# EAGLE design MSP430Geiger (EAGLE 8.1.0)

## Sheet 1 of 4
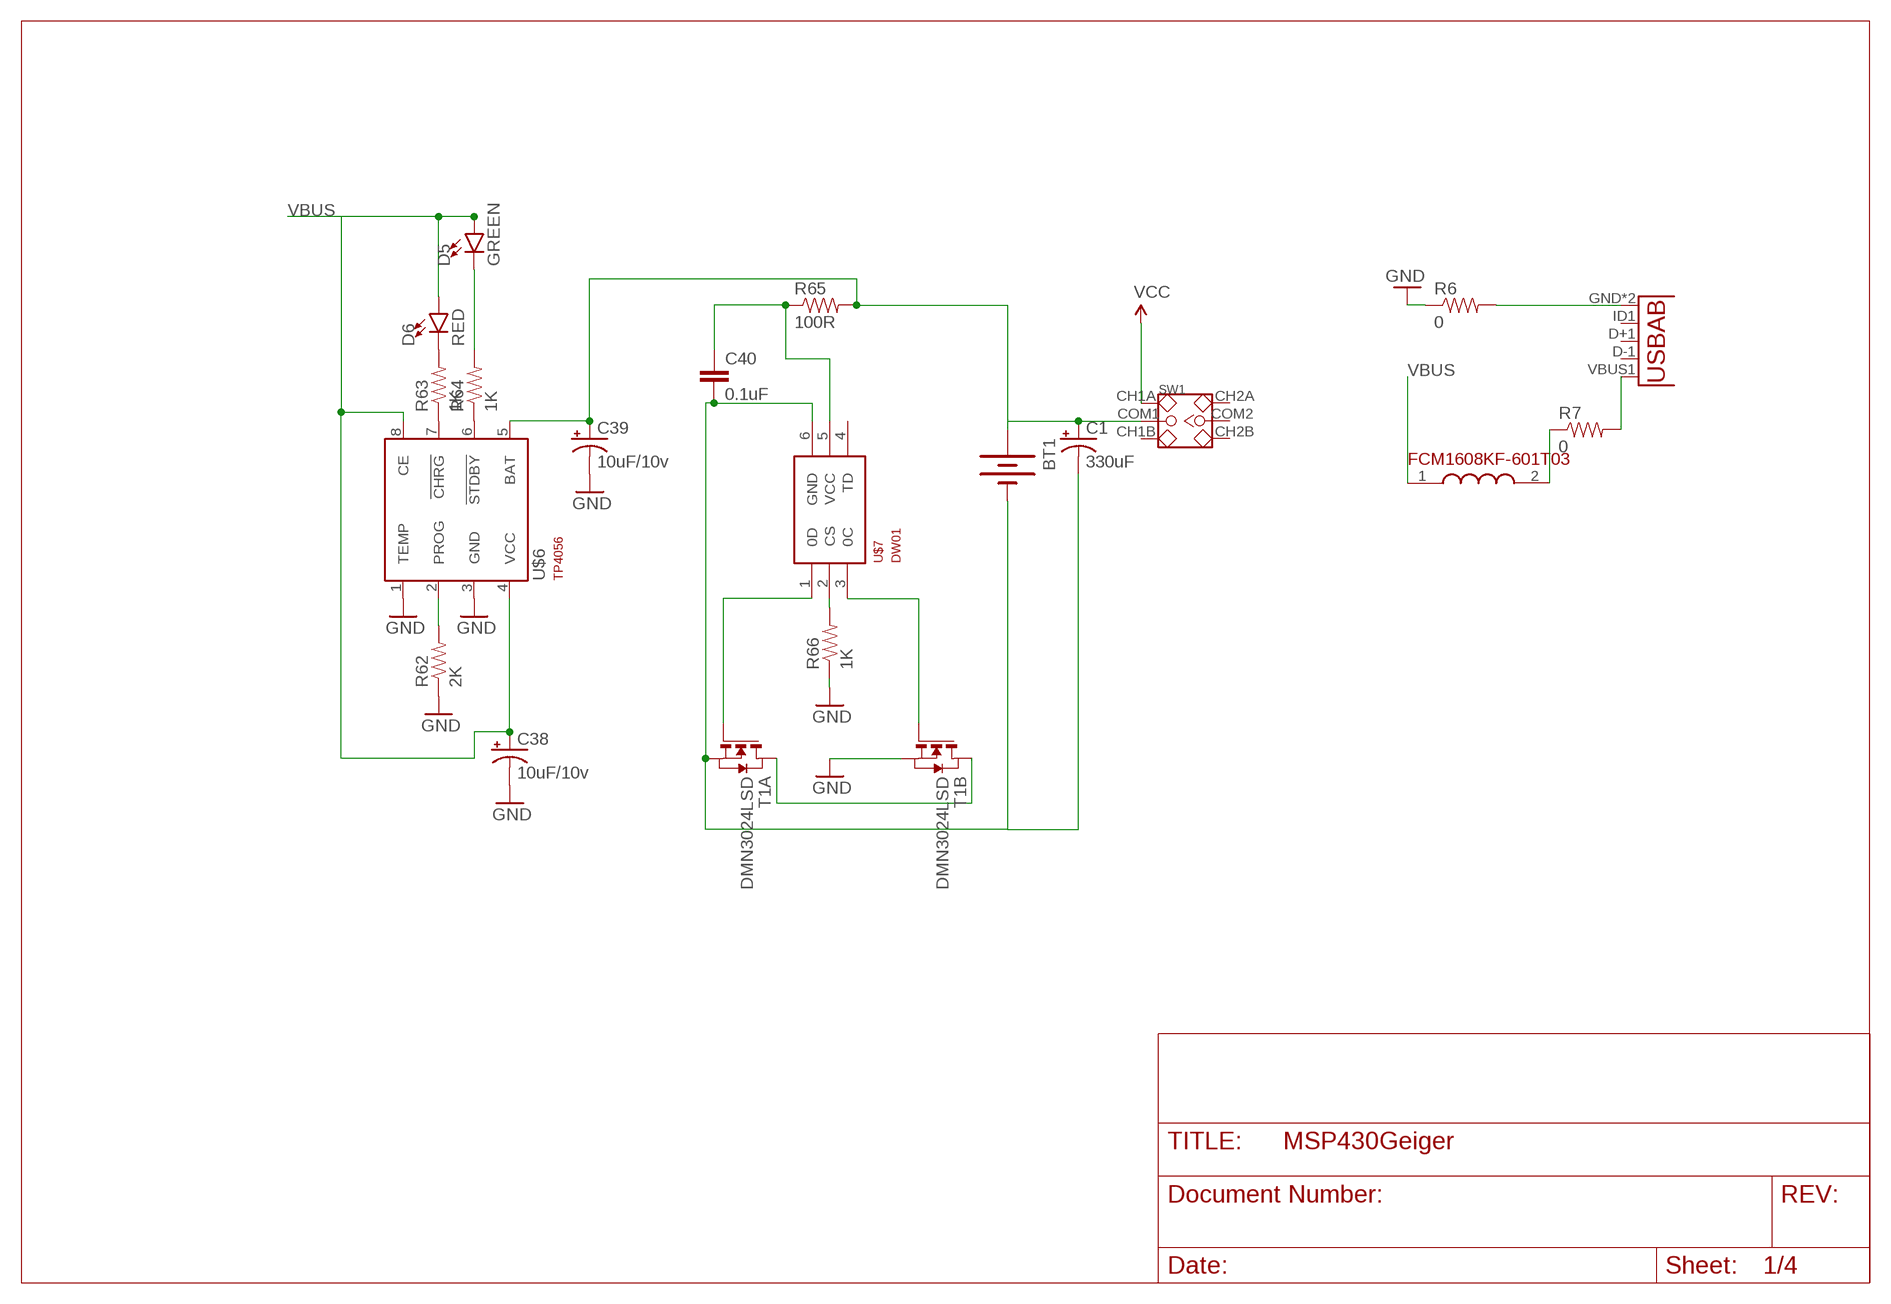
[diagram p0: schematic, sheet 1]

### Parts
BT1  BATTERYLIPO-TABS  [LIPO-110-TABS]
C1  330uF  CPOL-USE3.5-8  [E3,5-8]
C38  10uF/10v  CAP_POL1206-KIT  [EIA3216-KIT]
C39  10uF/10v  CAP_POL1206-KIT  [EIA3216-KIT]
C40  0.1uF  0.1UF-100V-10%(0603)  [0603-CAP]
D5  GREEN  LED-BLUE0603  [LED-0603]
D6  RED  LED-BLUE0603  [LED-0603]
R6  0  RESISTOR0805-RES  [0805]
R7  0  RESISTOR0805-RES  [0805]
R62  2K  1KOHM1/10W1%(0603)  [0603-RES]
R63  1K  1KOHM1/10W1%(0603)  [0603-RES]
R64  1K  1KOHM1/10W1%(0603)  [0603-RES]
R65  100R  1KOHM1/10W1%(0603)  [0603-RES]
R66  1K  1KOHM1/10W1%(0603)  [0603-RES]
SW1  SMD-TOGGLE-SWITCH-2CH(2X3P-7X3.5MM)  [SW6-2.54-SMD-7.0X3.5X1.5MM]
T1  DMN3024LSD  [TSSOP-8]
U1  USB""  [USB-MICRO-SMD]
U$4  FCM1608KF-601T03  [FCM1608KF-601T03]
U$6  TP4056  [SOT23-8]
U$7  DW01  [SOT23-6]

### Nets
GND: C38.C(-) C39.C(-) R6.1 R62.1 R66.1 T1.6(B:S) T1.7(B:S) U$6.1(TEMP) U$6.3(GND) ; also sheet 2,3,4
N$3: R7.2 U1.VBUS1(VBUS)
N$4: BT1.+ C1.+ C39.A(+) R65.2 SW1.COM1 U$6.5(BAT)
N$11: R7.1 U$4.2(2.OUT)
N$12: R6.2 U1.GND U1.GND1(GND)
N$58: R62.2 U$6.2(PROG)
N$59: R63.1 U$6.7(!CHRG)
N$60: R64.1 U$6.6(!STDBY)
N$61: D6.C R63.2
N$62: D5.C R64.2
N$65: C40.1 R65.1 U$7.5(VCC)
N$66: BT1.- C1.- C40.2 T1.2(A:S) T1.3(A:S) U$7.6(GND)
N$67: T1.4(A:G) U$7.1(0D)
N$68: R66.2 U$7.2(CS)
N$69: T1.1(A:D) T1.8(B:D)
N$70: T1.5(B:G) U$7.3(0C)
VBUS: C38.A(+) D5.A D6.A U$4.1(1.IN) U$6.4(VCC) U$6.8(CE)
VCC: SW1.CH1A ; also sheet 2
Unconnected: SW1.CH1B SW1.CH2A SW1.CH2B SW1.COM2 U1.D+1(D+) U1.D-1(D-) U1.ID1(USBID) U$7.4(TD)

## Sheet 2 of 4
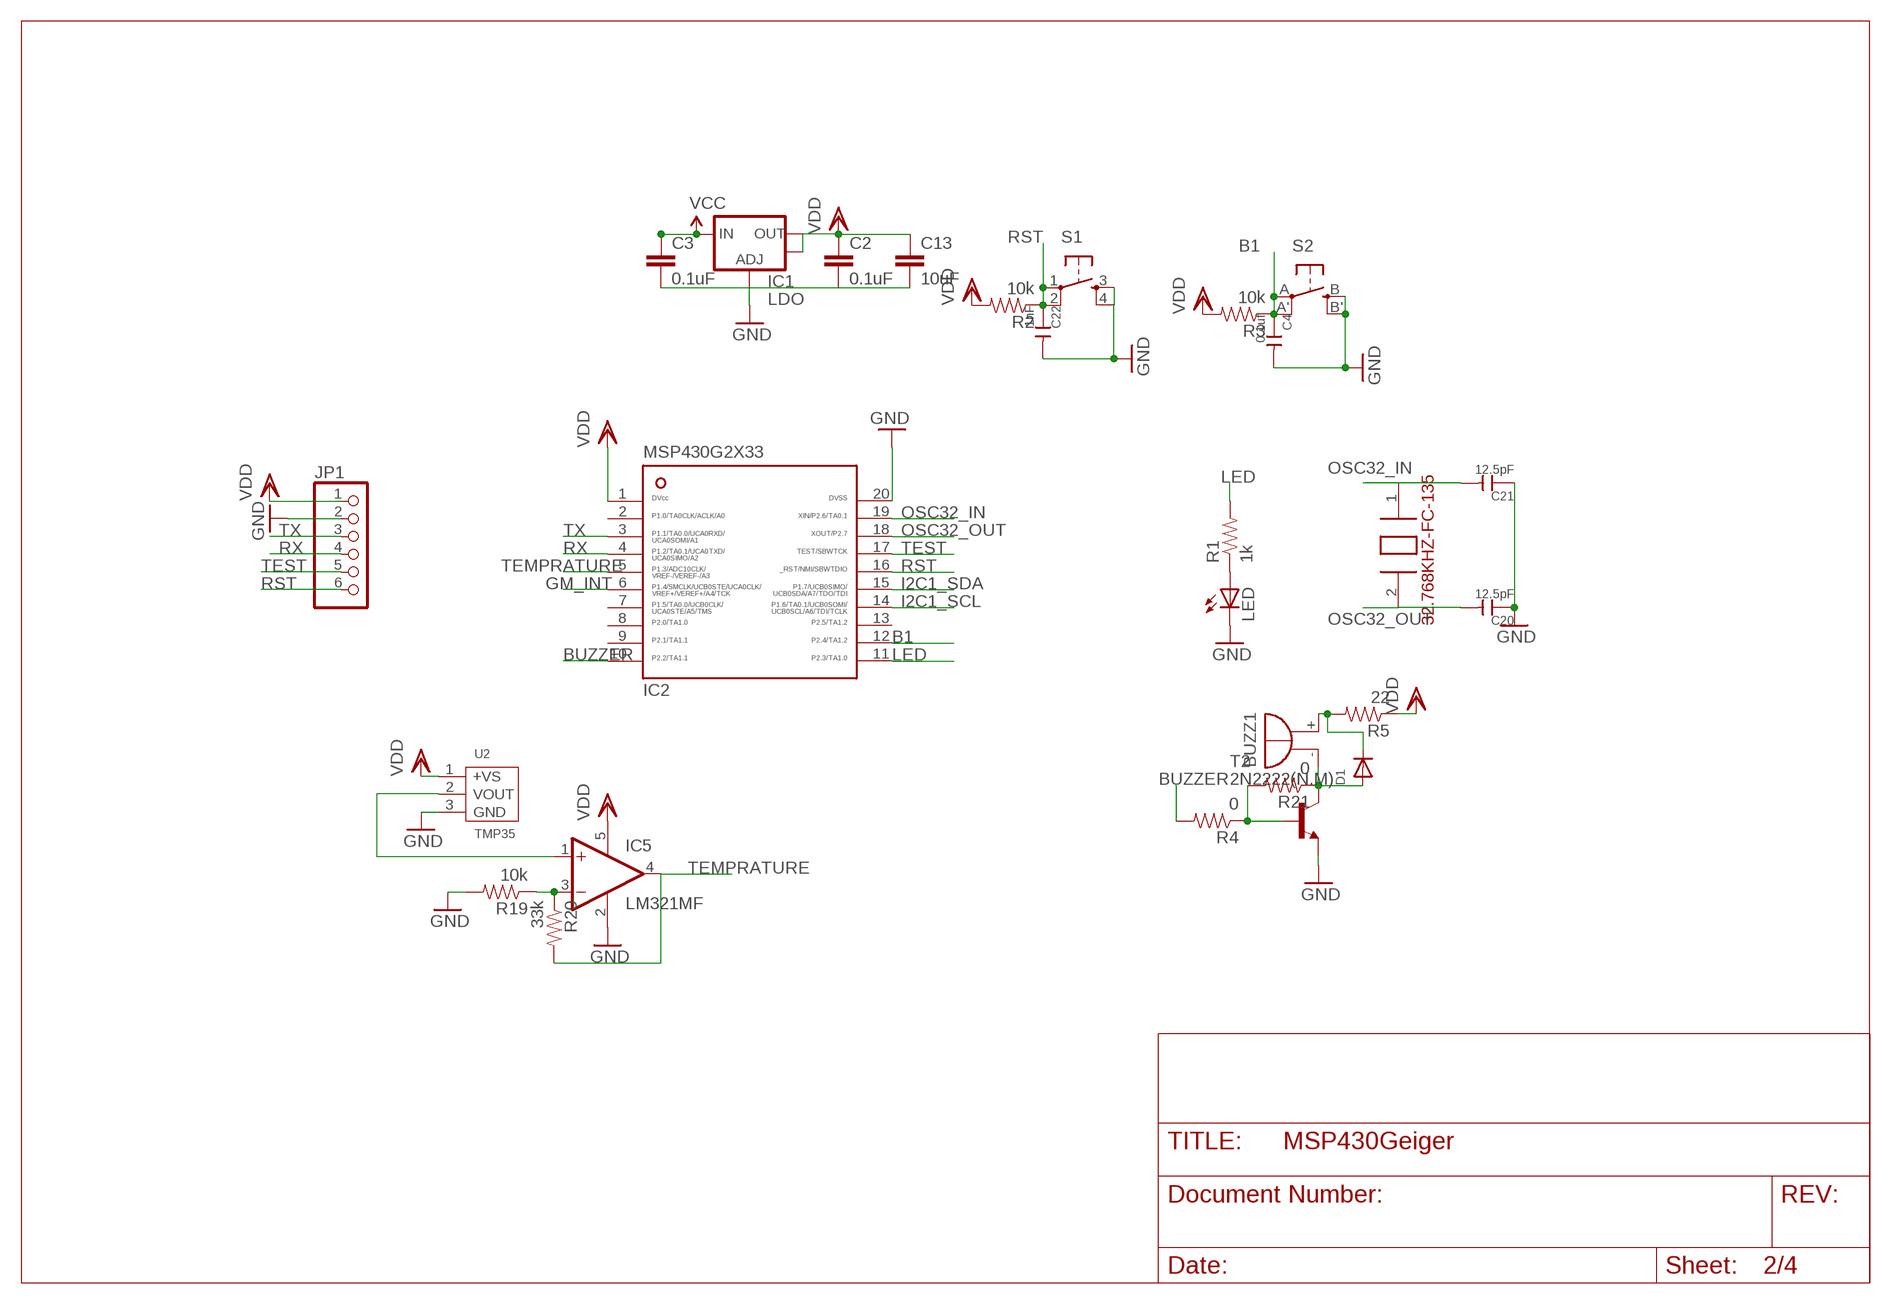
[diagram p1: schematic, sheet 2]

### Parts
BUZZ1  F/QMBIII  [F/QMBIII]
C2  0.1uF  0.1UF-25V(+80/-20%)(0603)  [0603-CAP]
C3  0.1uF  0.1UF-25V(+80/-20%)(0603)  [0603-CAP]
C4  0.1uf  CERAMIC-4.7UF-10V-10%-X5R(0603)  [C0603]
C13  10uF  0.1UF-25V(+80/-20%)(0603)  [0603-CAP]
C20  12.5pF  CERAMIC-4.7UF-10V-10%-X5R(0603)  [C0603]
C21  12.5pF  CERAMIC-4.7UF-10V-10%-X5R(0603)  [C0603]
C22  1nF  CERAMIC-4.7UF-10V-10%-X5R(0603)  [C0603]
D1  DIODESMA  [SMADIODE]
IC1  LDO  V_REG_LM1117SOT223  [SOT223]
IC2  MSP430  MSP430G2X33-20PW20  [PW20]
IC5  LM321MF  [SOT23-5]
JP1  PINHD-1X6  [1X06]
LED  LEDCHIP-LED0805  [CHIP-LED0805]
R1  1k  0.22OHM1/4W1%(0805)  [0805]
R2  10k  0OHM1/10W5%(0603)  [0603]
R3  10k  0OHM1/10W5%(0603)  [0603]
R4  0  0.22OHM1/4W1%(0805)  [0805]
R5  22  0.22OHM1/4W1%(0805)  [0805]
R19  10k  0.22OHM1/4W1%(0805)  [0805]
R20  33k  0.22OHM1/4W1%(0805)  [0805]
R21  0  0.22OHM1/4W1%(0805)  [0805]
S1  TAC_SWITCHSMD  [TACTILE_SWITCH_SMD]
S2  SPST_TACT-EVQQ2  [EVQ-Q2]
T2  2N2222(N.M)  -NPN-SOT23-EBC  [SOT23-EBC]
U2  TMP35  TEMPERATURE-TEM36(TO-92)  [TO-92-3]
U$8  32.768KHZ-FC-135  [32.768KHZ-FC-135]

### Nets
B1: C4.1 IC2.12 R3.1 S2.A'(P1) S2.A(P)
BUZZER: IC2.10 R4.2
GM_INT: IC2.6 ; also sheet 4
GND: C2.2 C3.2 C4.2 C13.2 C20.1 C21.1 C22.2 IC1.1(ADJ) IC2.20 IC5.2(V-) JP1.2 LED.C R19.2 S1.3 S1.4 S2.B'(S1) S2.B(S) T2.E U2.3(GND) ; also sheet 1,3,4
I2C1_SCL: IC2.14 ; also sheet 3
I2C1_SDA: IC2.15 ; also sheet 3
LED: IC2.11 R1.2
N$5: R4.1 R21.2 T2.B
N$6: LED.A R1.1
N$7: BUZZ1.-(+) D1.A R21.1 T2.C
N$8: BUZZ1.+(-) D1.C R5.2
N$26: IC5.3(-IN) R19.1 R20.1
N$27: IC5.1(+IN) U2.2(VOUT)
OSC32_IN: C21.2 IC2.19 U$8.1(1.XIN)
OSC32_OUT: C20.2 IC2.18 U$8.2(2.XIN)
RST: C22.1 IC2.16 JP1.6 R2.1 S1.1 S1.2
RX: IC2.4 JP1.4
TEMPRATURE: IC2.5 IC5.4(OUT) R20.2
TEST: IC2.17 JP1.5
TX: IC2.3 JP1.3
VCC: C3.1 IC1.3(IN) ; also sheet 1
VDD: C2.1 C13.1 IC1.2(OUT) IC1.4(OUT) IC2.1 IC5.5(V+) JP1.1 R2.2 R3.2 R5.1 U2.1(+VS) ; also sheet 3,4
Unconnected: IC2.2 IC2.7 IC2.8 IC2.9 IC2.13

## Sheet 3 of 4
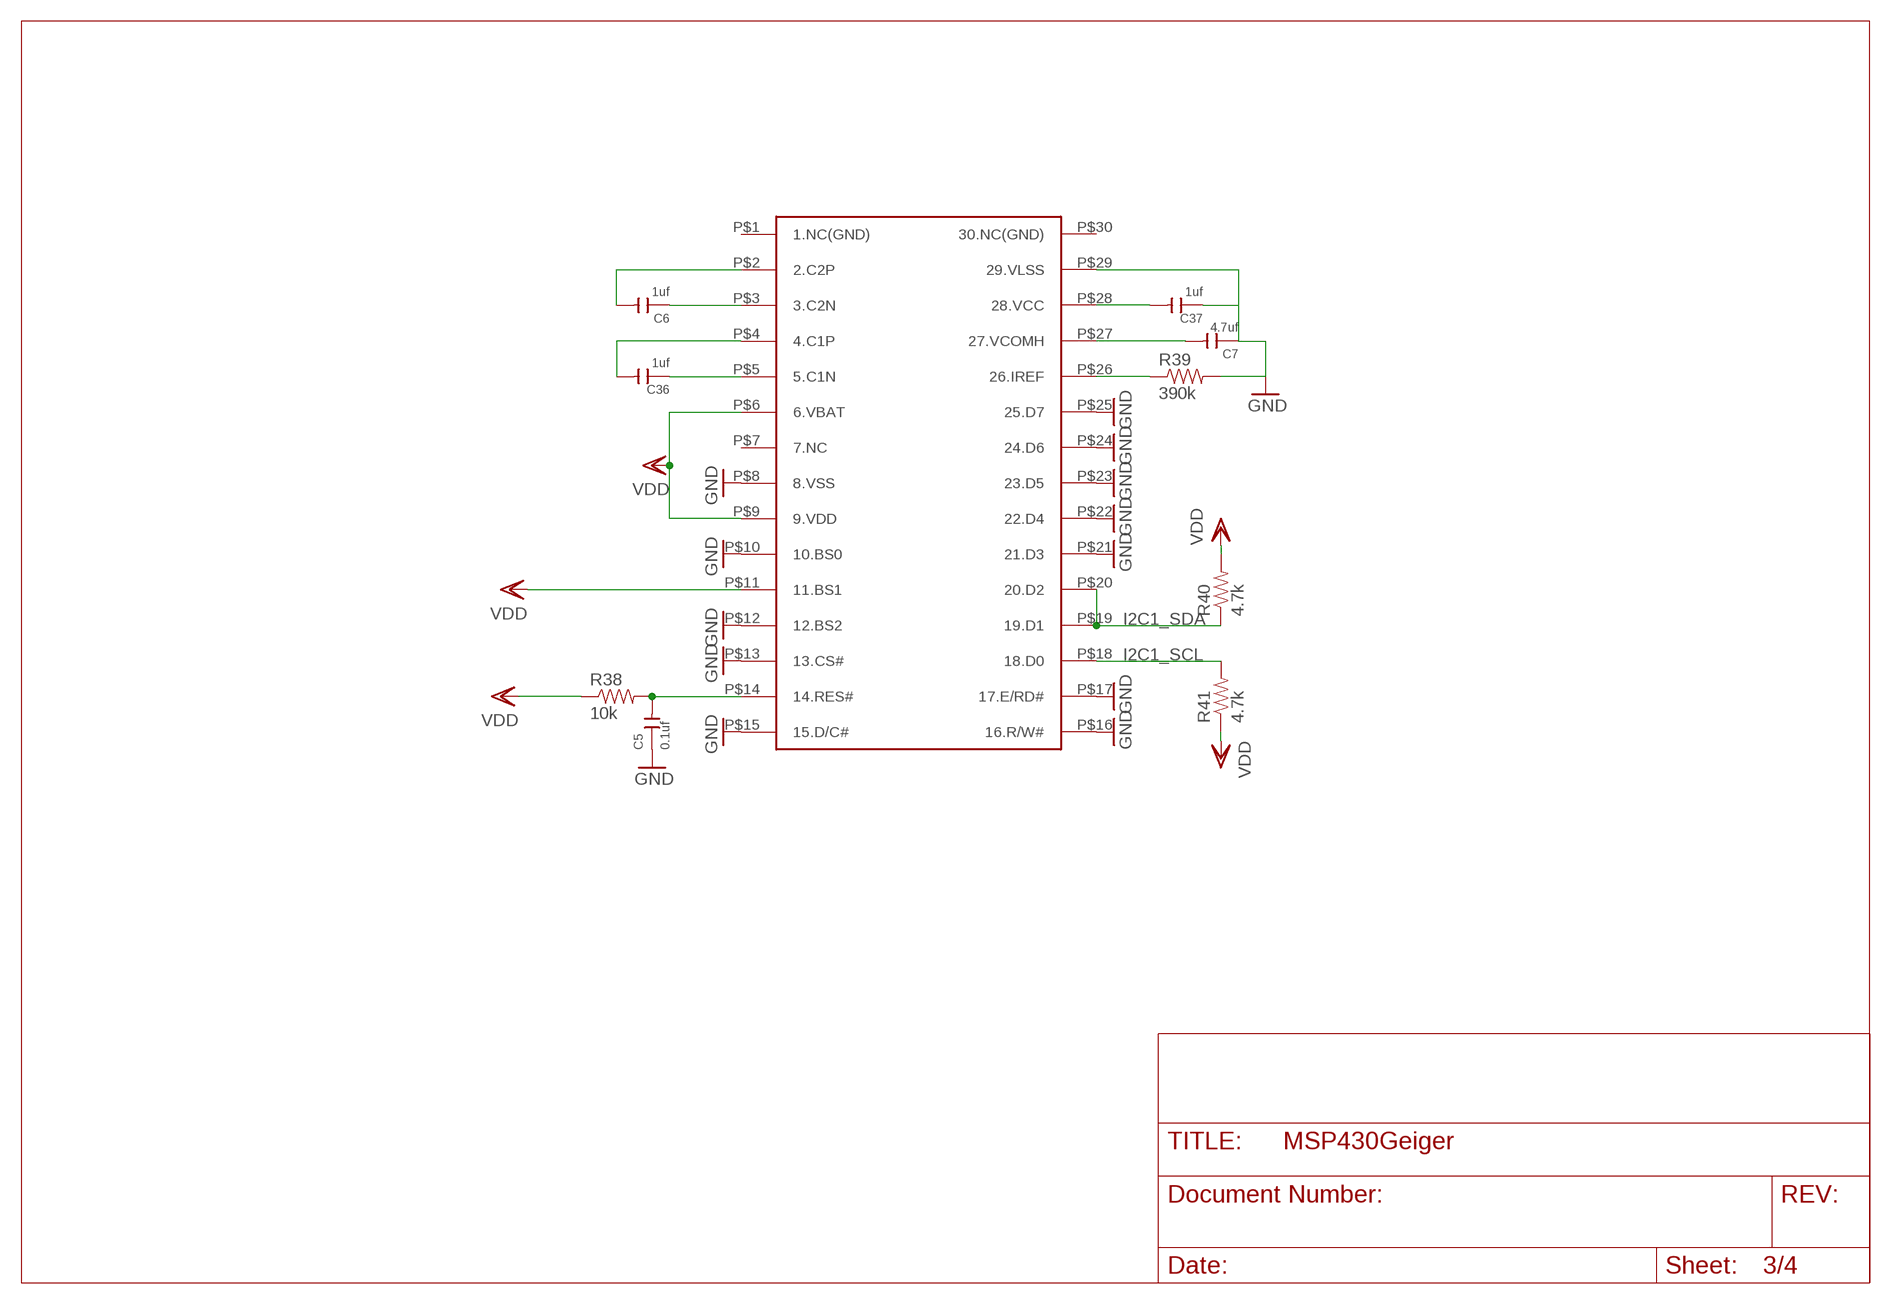
[diagram p2: schematic, sheet 3]

### Parts
C5  0.1uf  CERAMIC-4.7UF-10V-10%-X5R(0603)  [C0603]
C6  1uf  CERAMIC-4.7UF-10V-10%-X5R(0603)  [C0603]
C7  4.7uf  CERAMIC-4.7UF-10V-10%-X5R(0603)  [C0603]
C36  1uf  CERAMIC-4.7UF-10V-10%-X5R(0603)  [C0603]
C37  1uf  CERAMIC-4.7UF-10V-10%-X5R(0603)  [C0603]
R38  10k  0OHM1/10W5%(0603)  [0603]
R39  390k  0OHM1/10W5%(0603)  [0603]
R40  4.7k  0OHM1/10W5%(0603)  [0603]
R41  4.7k  0OHM1/10W5%(0603)  [0603]
U$18  ER-OLED0.96  [ER-OLED0.96]

### Nets
GND: C5.1 C7.1 C37.1 R39.2 U$18.P$8(8.VSS) U$18.P$10(10.BS0) U$18.P$12(12.BS2) U$18.P$13(13.CS#) U$18.P$15(15.D/C#) U$18.P$16(16.R/W#) U$18.P$17(17.E/RD#) U$18.P$21(21.D3) U$18.P$22(22.D4) U$18.P$23(23.D5) U$18.P$24(24.D6) U$18.P$25(25.D7) U$18.P$29(29.VLSS) ; also sheet 1,2,4
I2C1_SCL: R41.2 U$18.P$18(18.D0) ; also sheet 2
I2C1_SDA: R40.1 U$18.P$19(19.D1) U$18.P$20(20.D2) ; also sheet 2
N$1: C5.2 R38.2 U$18.P$14(14.RES#)
N$2: C6.1 U$18.P$3(3.C2N)
N$39: C36.1 U$18.P$5(5.C1N)
N$40: C6.2 U$18.P$2(2.C2P)
N$41: C36.2 U$18.P$4(4.C1P)
N$42: R39.1 U$18.P$26(26.IREF)
N$43: C7.2 U$18.P$27(27.VCOMH)
N$44: C37.2 U$18.P$28(28.VCC)
VDD: R38.1 R40.2 R41.1 U$18.P$6(6.VBAT) U$18.P$9(9.VDD) U$18.P$11(11.BS1) ; also sheet 2,4
Unconnected: U$18.P$1(1.NC(GND)) U$18.P$7(7.NC) U$18.P$30(30.NC(GND))

## Sheet 4 of 4
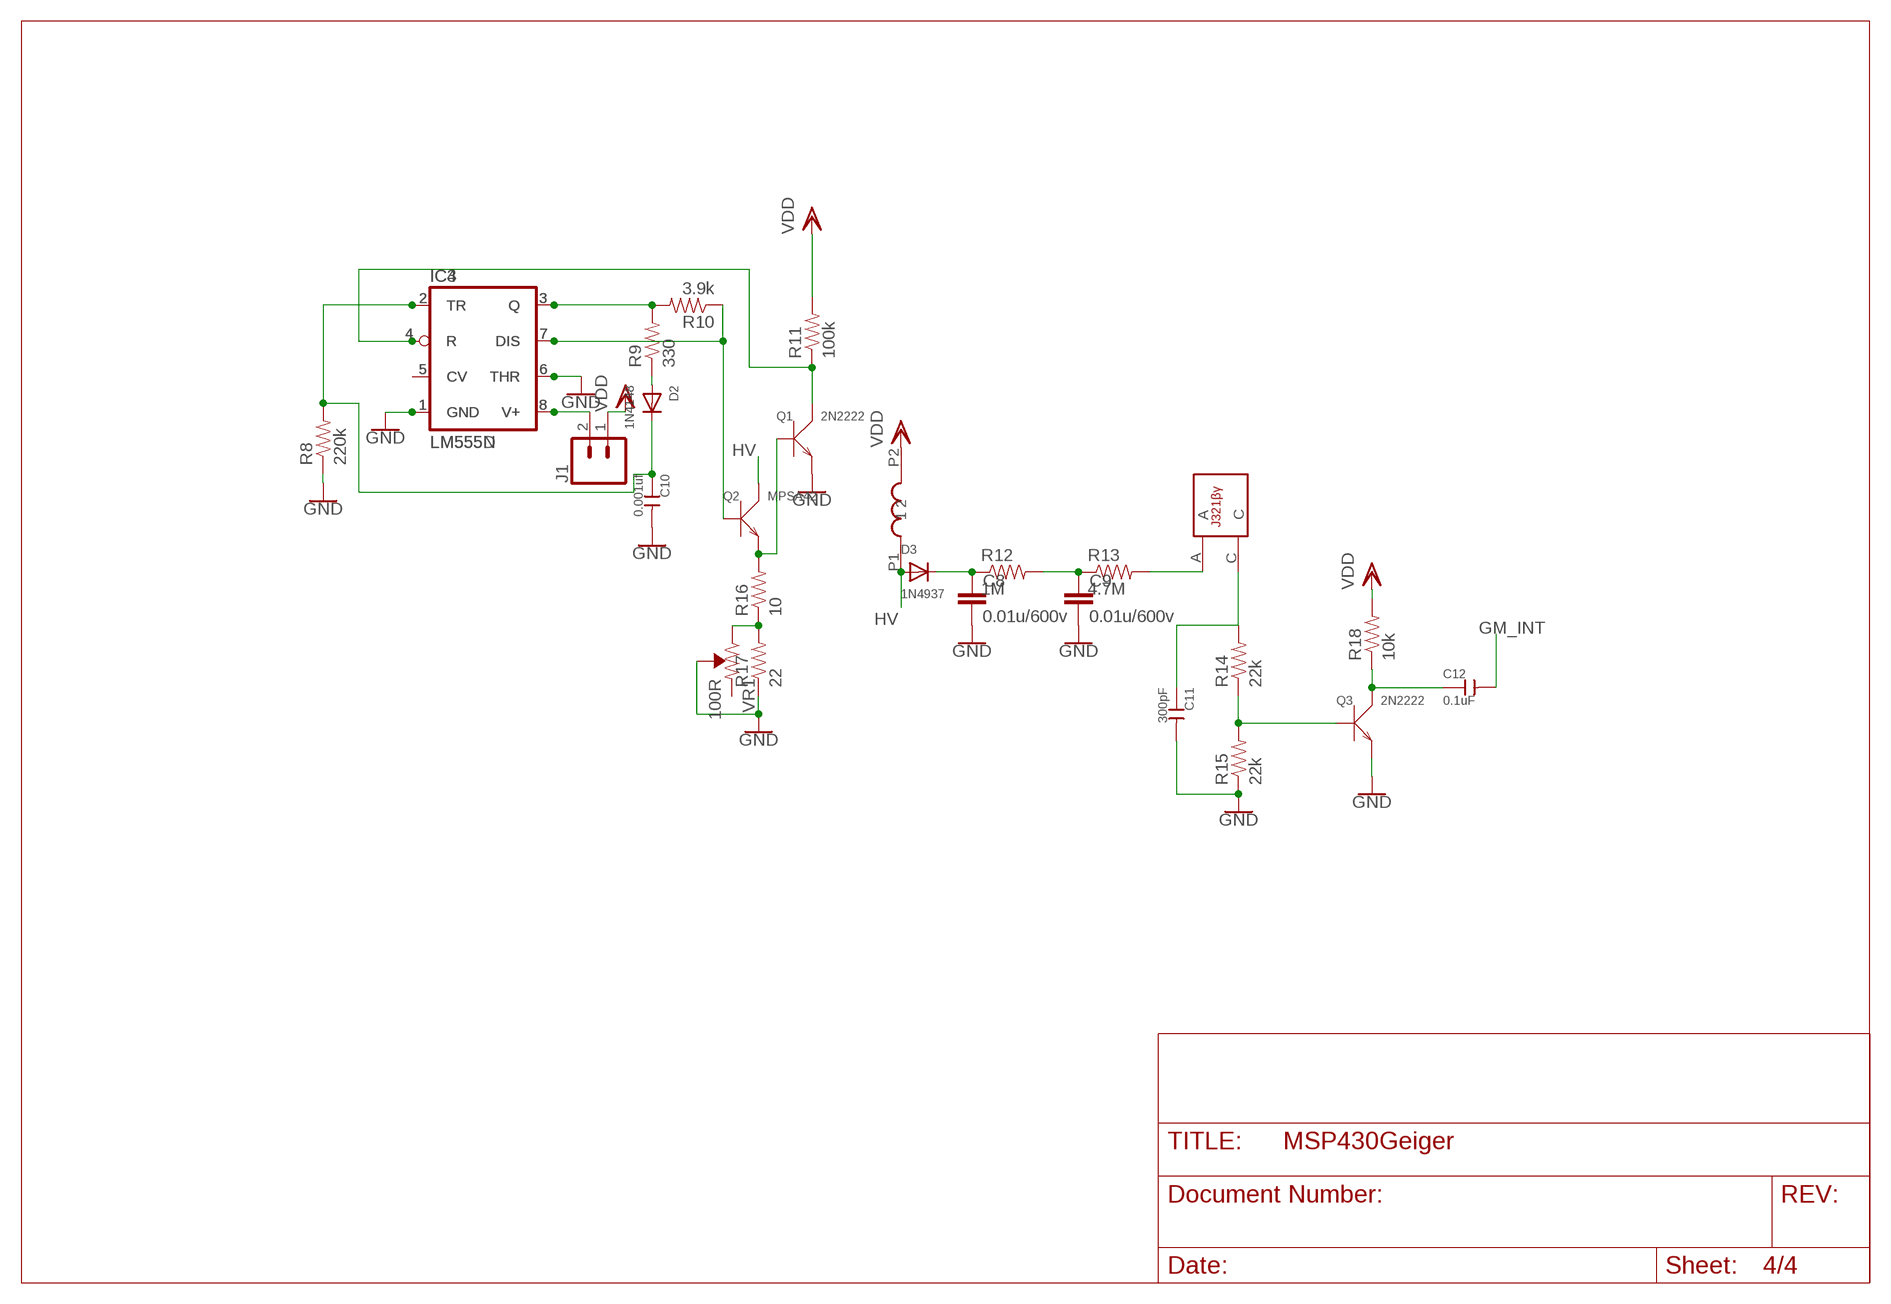
[diagram p3: schematic, sheet 4]

### Parts
C8  0.01u/600v  C15/5  [C15B5]
C9  0.01u/600v  C15/5  [C15B5]
C10  0.001uf  CERAMIC-4.7UF-10V-10%-X5R(0603)  [C0603]
C11  300pF  CERAMIC-4.7UF-10V-10%-X5R(0603)  [C0603]
C12  0.1uF  CERAMIC-4.7UF-10V-10%-X5R(0603)  [C0603]
D2  1N4148  DIODESMA  [SMADIODE]
D3  1N4937  DIODESMA  [SMADIODE]
IC3  LM555D  [SO08]
IC4  LM555N  [DIL08-ROUND]
J1  CONN_02  [1X02]
Q1  2N2222  TRANSISTOR-NPN  [SOT-23]
Q2  MPSA42  TRANSISTOR-NPN  [SOT-23]
Q3  2N2222  TRANSISTOR-NPN  [SOT-23]
R8  220k  0OHM1/10W5%(0603)  [0603]
R9  330  0OHM1/10W5%(0603)  [0603]
R10  3.9k  0OHM1/10W5%(0603)  [0603]
R11  100k  0OHM1/10W5%(0603)  [0603]
R12  1M  0OHM1/10W5%(0603)  [0603]
R13  4.7M  0OHM1/10W5%(0603)  [0603]
R14  22k  0OHM1/10W5%(0603)  [0603]
R15  22k  0OHM1/10W5%(0603)  [0603]
R16  10  0OHM1/10W5%(0603)  [0603]
R17  22  0OHM1/10W5%(0603)  [0603]
R18  10k  0OHM1/10W5%(0603)  [0603]
U$1  J321βγ  [J321βγ]
U$2  10mF  CD54  [CD54]
VR1  100R  TRIMPOT-SMD-3MM-CLOSED-1/8W-20%  [TRIMPOT-SMD-3MM-CLOSED]

### Nets
GM_INT: C12.2 ; also sheet 2
GND: C8.2 C9.2 C10.2 C11.2 IC3.1(GND) IC3.6(THR) IC4.1(GND) IC4.6(THR) Q1.2(E) Q3.2(E) R8.1 R15.1 R17.1 VR1.2(WIPER) ; also sheet 1,2,3
HV: D3.A Q2.3(C) U$2.P1
N$9: IC3.3(Q) IC4.3(Q) R9.2 R10.2
N$10: D2.A R9.1
N$13: IC3.7(DIS) IC4.7(DIS) Q2.1(B) R10.1
N$14: C10.1 D2.C IC3.2(TR) IC4.2(TR) R8.2
N$15: IC3.4(R) IC4.4(R) Q1.3(C) R11.1
N$16: Q1.1(B) Q2.2(E) R16.2
N$17: C8.1 D3.C R12.1
N$18: C9.1 R12.2 R13.1
N$19: R16.1 R17.2 VR1.3(CW)
N$20: IC3.5(CV) IC4.5(CV)
N$21: R13.2 U$1.A
N$22: C11.1 R14.2 U$1.C
N$23: Q3.1(B) R14.1 R15.2
N$24: IC3.8(V+) IC4.8(V+) J1.2
N$25: C12.1 Q3.3(C) R18.1
VDD: J1.1 R11.2 R18.2 U$2.P2 ; also sheet 2,3
Unconnected: VR1.1(CCW)

## Library data of the parts
BT1 = SparkFun-Retired:BATTERY: Battery - Single Cell A variety of battery chemistries, sizes, and footprints. Including AA, AAA, 18650 (PRT-12895), 20mm coin cell and 12mm coin cell. 20MM_4LEGS, BATT-10373
BUZZ1 = buzzer:F/QMBIII: BUZZER Source: Buerklin; OC_FARNELL: unknown; OC_NEWARK: unknown
C1 = adafruit:CPOL-US: POLARIZED CAPACITOR, American symbol
C2 C3 = SparkFun-Capacitors:0.1UF-25V(+80/-20%)(0603): CAP-00810 Ceramic Standard decoupling cap; PROD_ID: CAP-00810
C4-C6 C10-C12 C20-C22 C36 C37 = Seeed-OPL-Capacitor:CERAMIC-4.7UF-10V-10%-X5R(0603): 302010111; MPN: CC0603KRX5R6BB475; VALUE: 4.7uf
C7 = Seeed-OPL-Capacitor:CERAMIC-4.7UF-10V-10%-X5R(0603): 302010111; MPN: CC0603KRX5R6BB475
C8 C9 = capacitor-wima:C: CAPACITOR naming: grid - package width
C13 = SparkFun-Capacitors:0.1UF-25V(+80/-20%)(0603): CAP-00810 Ceramic Standard decoupling cap; PROD_ID: CAP-00810; VALUE: 0.1uF
C38 C39 = SparkFun-Capacitors:CAP_POL: Capacitor Polarized These are standard SMD and PTH capacitors. Normally 10uF, 47uF, and 100uF in electrolytic and tantalum varieties. Always verify the external diameter of the through hole cap, it varies with capacity, voltage, and manufacturer. The EIA devices should be standard.
C40 = SparkFun-Capacitors:0.1UF-100V-10%(0603): CAP-08390; PROD_ID: CAP-08390
D1-D3 = adafruit:DIODE: Diode SMADIODE - SMA Surface Mount Package 20V 1A Schottky Diode Digikey: 641-1014-6-ND DO-1N4148 - Through Hole Small Current Diode SOD-123 20V 1 A (.5mV Vf) Schottky Diode - Digikey: MBRX120TPMSCT-ND SOD-323 10V 570mA (.38mV Vf, 3ns) Schottky Diode - Digikey: ZLLS410CT-ND SOD-523 30V 30mA Schottky Diode (RB751S-40TE61) - Digikey: RB751S-40TE61CT-ND SOT23-R/W - SOT23 Package (R = Solder Paste/Reflow Ovens, W = Hand-Soldering) BAT54Film 40V 300mA - Digikey: 497-7162-1-ND
D5 D6 = SparkFun-LED:LED-BLUE: Blue SMD LED Used in manufacturing of various products at SparkFun Packages: 0603 - SMD 0603 package [Product Link] <http://www.digikey.com/product-detail/en/SMLE12BC7TT86/511-1589-2-ND/1641808> 1206 - SMD1206 package [Product Link] <http://www.digikey.com/product-detail/en/lite-on-inc/LTST-C150TBKT/160-1643-1-ND/573584> SparkFun Products: ESP8266 Thing-Dev Board <https://www.sparkfun.com/products/13711> RedBoard <https://www.sparkfun.com/products/12757>; PROD_ID: DIO-08575; VALUE: BLUE
IC1 = SparkFun-PowerIC:V_REG_LM1117: Voltage Regulator LM1117 Standard adjustable voltage regulator but in SMD form. Spark Fun Electronics SKU : COM-00595
IC2 = ti_msp430:MSP430G2X33-20
IC3 IC4 = adafruit:*555: TIMER Changed DIP package to have round (not oval) pin pads http://www.ladyada.net/library/pcb/eaglelibrary.html
IC5 = linear:LM321?*: Low Power Single Op Amp Source: http://cache.national.com/ds/LM/LM321.pdf
J1 = SparkFun-Connectors:CONN_02: Multi connection point. Often used as Generic Header-pin footprint for 0.1 inch spaced/style header connections On any of the 0.1 inch spaced packages, you can populate with these: Break Away Headers - Straight <https://www.sparkfun.com/products/116> (PRT-00116) Break Away Male Headers - Right Angle <https://www.sparkfun.com/products/553> (PRT-00553) Female Headers <https://www.sparkfun.com/products/115> (PRT-00115) Break Away Headers - Machine Pin <https://www.sparkfun.com/products/117> (PRT-00117) Break Away Female Headers - Swiss Machine Pin <https://www.sparkfun.com/products/743> (PRT-00743) For SCREWTERMINALS and SPRING TERMINALS visit here: Screw Terimnals on SparkFun.com <https://www.sparkfun.com/search/results?term=Screw+Terminals> (5mm/3.5mm/2.54mm spacing) This device is also useful as a general connection point to wire up your design to another part of your project. Our various solder wires solder well into these plated through hole pads. Hook-Up Wire - Assortment (Stranded, 22 AWG) <https://www.sparkfun.com/products/11375> (PRT-11375) Hook-Up Wire - Assortment (Solid Core, 22 AWG) <https://www.sparkfun.com/products/11367> (PRT-11367) View the entire wire category on our website here <https://www.sparkfun.com/categories/141> Special notes: Molex polarized connector foot print use with: PRT-08233 with associated crimp pins and housings. 2.54_SCREWTERM for use with PRT-10571. 3.5mm Screw Terminal footprints for PRT-08084 5mm Screw Terminal footprints for use with PRT-08432
JP1 = pinhead:PINHD-1X6: PIN HEADER
LED = adafruit:LED: LED OSRAM: - CHIPLED LG R971, LG N971, LY N971, LG Q971, LY Q971, LO R971, LY R971 LH N974, LH R974 LS Q976, LO Q976, LY Q976 LO Q996 - Hyper CHIPLED LW Q18S LB Q993, LB Q99A, LB R99A - SideLED LS A670, LO A670, LY A670, LG A670, LP A670 LB A673, LV A673, LT A673, LW A673 LH A674 LY A675 LS A676, LA A676, LO A676, LY A676, LW A676 LS A679, LY A679, LG A679 - Hyper Micro SIDELED® LS Y876, LA Y876, LO Y876, LY Y876 LT Y87S - SmartLED LW L88C, LW L88S LB L89C, LB L89S, LG L890 LS L89K, LO L89K, LY L89K LS L896, LA L896, LO L896, LY L896 - TOPLED LS T670, LO T670, LY T670, LG T670, LP T670 LSG T670, LSP T670, LSY T670, LOP T670, LYG T670 LG T671, LOG T671, LSG T671 LB T673, LV T673, LT T673, LW T673 LH T674 LS T676, LA T676, LO T676, LY T676, LB T676, LH T676, LSB T676, LW T676 LB T67C, LV T67C, LT T67C, LS T67K, LO T67K, LY T67K, LW E67C LS E67B, LA E67B, LO E67B, LY E67B, LB E67C, LV E67C, LT E67C LW T67C LS T679, LY T679, LG T679 LS T770, LO T770, LY T770, LG T770, LP T770 LB T773, LV T773, LT T773, LW T773 LH T774 LS E675, LA E675, LY E675, LS T675 LS T776, LA T776, LO T776, LY T776, LB T776 LHGB T686 LT T68C, LB T68C - Hyper Mini TOPLED® LB M676 - Mini TOPLED Santana® LG M470 LS M47K, LO M47K, LY M47K Source: http://www.osram.convergy.de/
Q1-Q3 = Seeed-OPL-Transistor:TRANSISTOR-NPN*: NPN Transistor
R1 R4 R5 R19-R21 = SparkFun-Resistors:0.22OHM1/4W1%(0805): RES-09883; PROD_ID: RES-09883; VALUE: 0.22
R2 R3 R8-R18 R38-R41 = SparkFun-Resistors:0OHM1/10W5%(0603): RES-08609; PROD_ID: RES-08609; VALUE: 0
R6 R7 = SparkFun-Resistors:RESISTOR: Resistor Basic schematic elements and footprints for 0603, 1206, and PTH resistors.
R62 R65 = SparkFun-Resistors:1KOHM1/10W1%(0603): RES-07856; PROD_ID: RES-07856; VALUE: 1K
R63 R64 R66 = SparkFun-Resistors:1KOHM1/10W1%(0603): RES-07856; PROD_ID: RES-07856
S1 = SparkFun-Electromechanical:TAC_SWITCH: Momentary Switch Button commonly used for reset or general input. Spark Fun Electronics SKU : COM-00097 SMT- SWCH-08247; PROD_ID: SWCH-08247
S2 = adafruit:SPST_TACT: SMT 6mm switch, EVQQ2 series http://www.ladyada.net/library/eagle
SW1 = Seeed-OPL-Switch:SMD-TOGGLE-SWITCH-2CH(2X3P-7X3.5MM): 311030005
T1 = FS8205A:DMN3024LSD: DUAL N-CHANNEL ENHANCEMENT MODE MOSFET data sheet <http://goo.gl/dRgboR> Dave.Calaway Eagle Library <https://goo.gl/Muy1Tr>
T2 = transistor:*-NPN-: NPN Transistror BF959 corrected 2008.03.06
U1 = MicroUSB Long GND:USB: This is a USB AB connector that is compatible with USB OTG. i.e. this connector can serve as a host or device
U2 = Seeed-OPL-sensor:TEMPERATURE-TEM36(TO-92): 314010011; MPN: TEM36; VALUE: TEM36
U$1 = J321βγ:J321βγ
U$2 = CD54:CD54
U$4 = FCM1608KF-601T03:FCM1608KF-601T03
U$6 = TP4056:TP4056: TP4056 Data sheet <http://goo.gl/J7k8TF> Dave.Calaway Eagle Library <https://goo.gl/Muy1Tr>
U$7 = DW01:DW01: The DW01-P battery protection IC is designed to protect lithium-ion/polymer battery from damage or degrading the lifetime due to overcharge, overdischarge, and/or overcurrent for one-cell lithium-ion/polymer battery powered systems, such as cellular phones. Data sheet <http://goo.gl/4y108d> Dave.Calaway Eagle Library <https://goo.gl/Muy1Tr>
U$8 = 32.768KHZ-FC-135:32.768KHZ-FC-135
U$18 = ER-OLED0.96:ER-OLED0.96
VR1 = SparkFun-Resistors:TRIMPOT: Trimming Potentiometer (Trimpot) Three-terminal potentiometers, with an adjustable wiper and two adjustable resistors. A pot can be used to create a configurable voltage divider, or as a variable resistor. "Trimpots" are a subset of potentiometers, usually intended for "set-and-forget" applications. They're often more delicate than standard potentiometers - rated for fewer turns. Variants PTH-KNOB - PTH Trimpot w/ finger-adjustable knob Trimpot 10K with Knob <https://www.sparkfun.com/products/9806> (COM-09806) Datasheet <http://www.sparkfun.com/datasheets/Components/General/TSR-3386.pdf> SMD-3MM-CLOSED-FRAME - SMD 3mm Square Closed-Frame Trimpot Used on e.g. EasyDriver - Stepper Motor Driver <https://www.sparkfun.com/products/12779> Datasheet <http://www.bitechnologies.com/pdfs/22.pdf> (22AR10KTR) SMD-5MM - SMD 5mm Square Closed-Frame Trimpot Used on e.g. IOIO-OTG - V2.2 <https://www.sparkfun.com/products/13613> Datasheet <http://www.vishay.com/docs/51008/ts53.pdf> (TS53YL502MR10) SMD-3MM-1/10W-25% - 3mm Square Open-Frame Trimpot Used on e.g. SparkFun Shapeoko <https://www.sparkfun.com/products/13899> Datasheet <http://www.bourns.com/docs/Product-Datasheets/TC33.pdf> (TC33X-2-103E); PROD_ID: RES-09285; VALUE: 10k

## Board
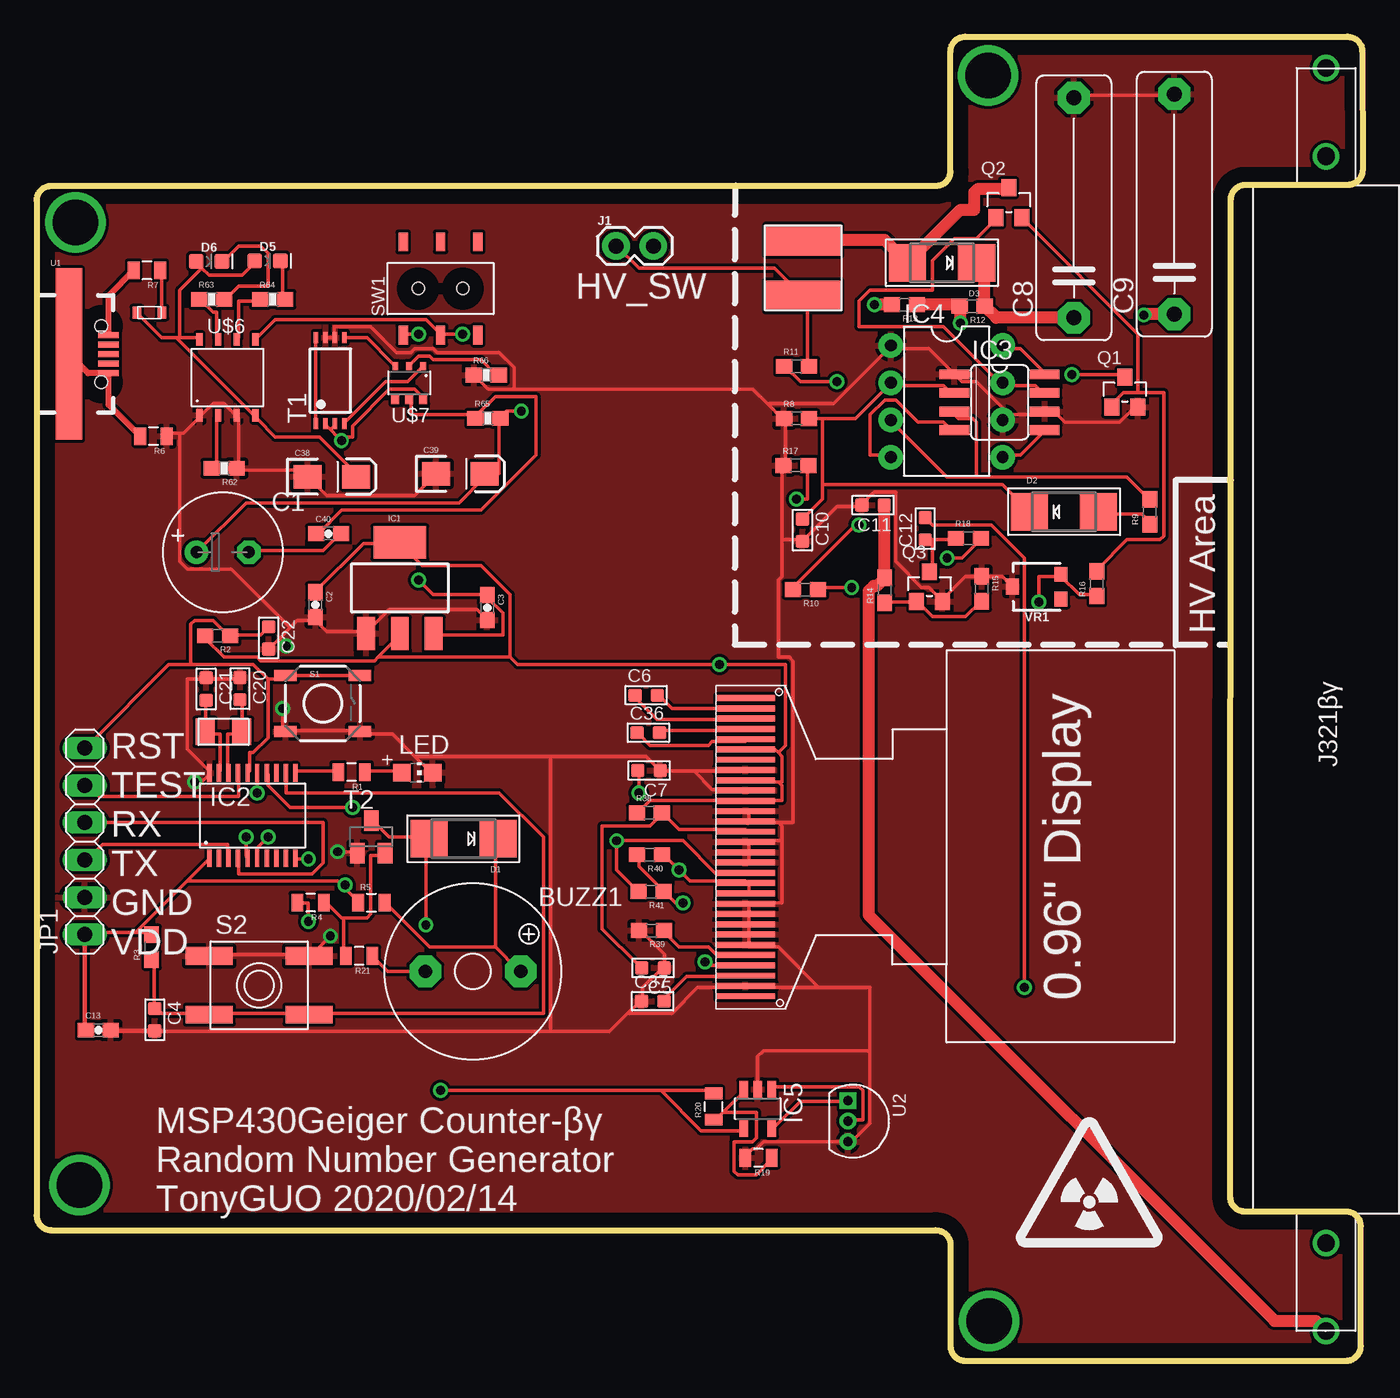
[diagram p4: board, top side]
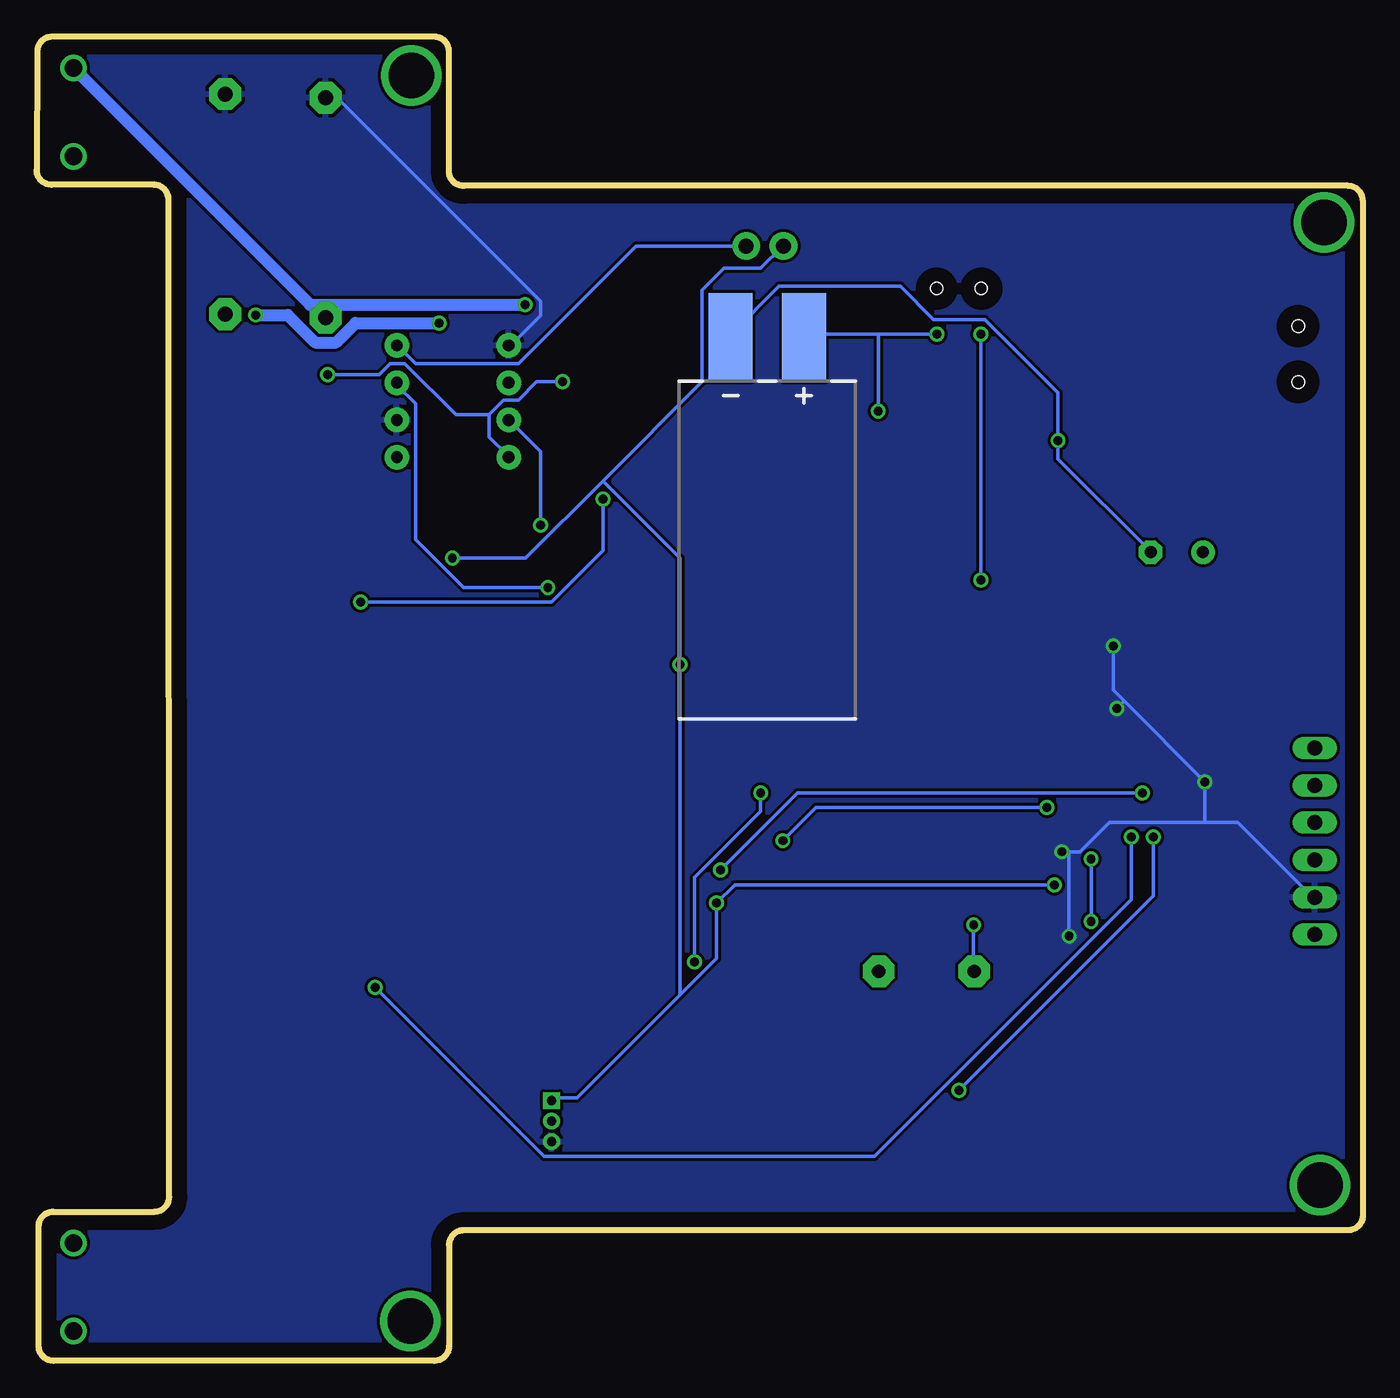
[diagram p5: board, bottom side, seen from below]

Size 90.31 x 90.17 mm. Coordinates in mm from the lower left corner, seen from the top.
Outline: 82.33,80.09 89.31,80.09 arc90 90.31,81.09 90.27,89.17 arc90 89.27,90.17 63.23,90.17 arc90 62.23,89.17 62.23,81.01 arc-90 61.23,80.01 1,80.01 arc90 0,79.01 0,9.89 arc90 1,8.89 61.23,8.89 arc-90 62.23,7.89 62.23,1 arc90 63.23,0 89.17,0 arc90 90.17,1 90.17,9.16 arc90 89.17,10.16 82.28,10.16 arc-90 81.28,11.16 81.33,79.09 arc-90 82.33,80.09
Copper layers (1*16): Top 0.035mm / dielectric 1.5mm / Bottom 0.035mm
Design rules "default": minimum track width 10mil, minimum drill 24mil, track to track 8mil, track to pad 8mil, pad to pad 8mil, via to via 8mil, smd to smd 8mil, copper to edge 40mil, drill to drill 8mil, minimum pad ring 10mil, minimum via ring 8mil, stop-mask expansion 4mil, vias tented up to drill 0mil, thermal gap 10mil

### Footprints (pad centres in the part's own frame; a part is rotated, then mirrored left to right if it is on the bottom)
LIPO-110-TABS = smd 3 x 6: + 2.5,14.5; - -2.5,14.5
F/QMBIII = drill 0.914 pad 2.159 octagon: + 3.251,0; - -3.251,0
E3,5-8 = drill 0.813 pad 1.6: + -1.778,0 | drill 0.813 pad 1.6 octagon: - 1.778,0
0603-CAP = smd 1.1 x 1: 1 -0.85,0; 2 0.85,0
C0603 = smd 0.889 x 0.889: 1 0,0.762; 2 0,-0.762
C15B5 = drill 1.016 pad 2.159 octagon: 1 -7.493,0; 2 7.493,0
EIA3216-KIT = smd 1.9 x 1.6: A 1.65,0; C -1.65,0
SMADIODE = smd 2.54 x 2.54: A 2.349,0; C -2.349,0
LED-0603 = smd 1 x 1: A -0.877,0; C 0.877,0
SOT223 = smd 1.219 x 2.235: 1 -2.311,-3.099; 2 0,-3.099; 3 2.311,-3.099 | smd 3.6 x 2.2: 4 0,3.099
PW20 = smd 0.3 x 1.2: 1 -2.925,-2.9; 2 -2.275,-2.9; 3 -1.625,-2.9; 4 -0.975,-2.9; 5 -0.325,-2.9; 6 0.325,-2.9; 7 0.975,-2.9; 8 1.625,-2.9; 9 2.275,-2.9; 10 2.925,-2.9; 11 2.925,2.9; 12 2.275,2.9; 13 1.625,2.9; 14 0.975,2.9; 15 0.325,2.9; 16 -0.325,2.9; 17 -0.975,2.9; 18 -1.625,2.9; 19 -2.275,2.9; 20 -2.925,2.9
SO08 = smd 0.66 x 2.032: 1 -1.905,-3.073; 2 -0.635,-3.073; 3 0.635,-3.073; 4 1.905,-3.073; 5 1.905,3.073; 6 0.635,3.073; 7 -0.635,3.073; 8 -1.905,3.073
DIL08-ROUND = drill 0.813 pad 1.676: 1 -3.81,-3.81; 2 -1.27,-3.81; 3 1.27,-3.81; 4 3.81,-3.81; 5 3.81,3.81; 6 1.27,3.81; 7 -1.27,3.81; 8 -3.81,3.81
SOT23-5 = smd 0.6 x 1.2: 1 -0.95,-1.306; 2 0,-1.306; 3 0.95,-1.306; 4 0.95,1.306; 5 -0.95,1.306
1X02 = drill 1.016 pad 1.88: 1 0,0; 2 2.54,0
1X06 = drill 1.016 long: 1 -6.35,0; 2 -3.81,0; 3 -1.27,0; 4 1.27,0; 5 3.81,0; 6 6.35,0
CHIP-LED0805 = smd 1.2 x 1.2: A 0,-1.05; C 0,1.05
SOT-23 = smd 1.016 x 1.143: 1 -0.889,-1.016; 2 0.889,-1.016; 3 0,1.016
0805 = smd 0.8 x 1.2: 1 -0.9,0; 2 0.9,0
0603 = smd 1.1 x 1: 1 -0.85,0; 2 0.85,0
0603-RES = smd 1.1 x 1: 1 -0.85,0; 2 0.85,0
TACTILE_SWITCH_SMD = smd 1.524 x 0.762: 1 -2.54,1.905; 2 2.54,1.905; 3 -2.54,-1.905; 4 2.54,-1.905
EVQ-Q2 = smd 3.2 x 1.2: A -3.4,-2; A' 3.4,-2; B -3.4,2; B' 3.4,2
SW6-2.54-SMD-7.0X3.5X1.5MM = smd 1.27 x 0.635: CH1A -3.175,2.54; CH1B -3.175,-2.54; CH2A 3.175,2.54; CH2B 3.175,-2.54; COM1 -3.175,0; COM2 3.175,0 | hole 0.813: 0,1.524; 0,-1.524
TSSOP-8 = smd 0.3 x 0.75: 1 -0.975,-2.925; 2 -0.325,-2.925; 3 0.325,-2.925; 4 0.975,-2.925; 5 0.975,2.925; 6 0.325,2.925; 7 -0.325,2.925; 8 -0.975,2.925
SOT23-EBC = smd 1 x 1.4: B 0.95,-1.1; C 0,1.1; E -0.95,-1.1
USB-MICRO-SMD = smd 1.4 x 0.4: D+1 2.7,0; D-1 2.7,0.65; GND1 2.7,-1.3; ID1 2.7,-0.65; VBUS1 2.7,1.3 | smd 1.778 x 11.684: GND 0,0 | hole 0.85: 2.2,1.9; 2.2,-1.9
TO-92-3 = drill 0.635 pad 1.143 square: 1 -1.397,0 | drill 0.635 pad 1.143: 2 0,0; 3 1.397,0
J321βγ = drill 1.2: A -8,5; C 78,5; P$2 -2,5; P$4 72,5
CD54 = smd 5.2 x 2.1: P1 2.6,-1; P2 2.6,-4.8
FCM1608KF-601T03 = smd 0.6 x 0.8: 1 -0.05,0.4; 2 1.65,0.4
SOT23-8 = smd 0.42 x 0.835: 1 -1.905,-2.58; 2 -0.635,-2.58; 3 0.635,-2.58; 4 1.905,-2.58; 5 1.905,2.58; 6 0.635,2.58; 7 -0.635,2.58; 8 -1.905,2.58
SOT23-6 = smd 0.4 x 0.55: 1 -0.95,-1.15; 2 0,-1.15; 3 0.95,-1.15 | smd 0.55 x 0.55: 4 0.95,1.15; 5 0,1.15; 6 -0.95,1.15
32.768KHZ-FC-135 = smd 1.3 x 1.8: 1 0,0; 2 2.5,0
ER-OLED0.96 = smd 0.4 x 4: P$1 0.85,2; P$2 1.55,2; P$3 2.25,2; P$4 2.95,2; P$5 3.65,2; P$6 4.35,2; P$7 5.05,2; P$8 5.75,2; P$9 6.45,2; P$10 7.15,2; P$11 7.85,2; P$12 8.55,2; P$13 9.25,2; P$14 9.95,2; P$15 10.65,2; P$16 11.35,2; P$17 12.05,2; P$18 12.75,2; P$19 13.45,2; P$20 14.15,2; P$21 14.85,2; P$22 15.55,2; P$23 16.25,2; P$24 16.95,2; P$25 17.65,2; P$26 18.35,2; P$27 19.05,2; P$28 19.75,2; P$29 20.45,2; P$30 21.15,2
TRIMPOT-SMD-3MM-CLOSED = smd 1 x 0.9: 1 -0.85,-1.65; 3 0.85,-1.65 | smd 1.1 x 0.9: 2 0,1.65

### Placement (x,y rotation side)
BT1  40.55,55.22 0 bottom
BUZZ1  29.71,26.52 0 top
C1  12.67,55.07 0 top
C2  18.98,51.49 270 top
C3  30.68,51.29 270 top
C4  8.04,23.22 0 top
C5  41.97,26.76 270 top
C6  41.5,45.33 90 top
C7  41.7,40.2 270 top
C8  70.63,78.52 90 top
C9  77.47,78.77 90 top
C10  52.15,56.57 0 top
C11  56.95,58.27 270 top
C12  60.5,56.67 180 top
C13  4.2,22.52 0 top
C20  13.84,45.78 0 top
C21  11.54,45.75 0 top
C22  15.79,49.23 0 top
C36  41.65,42.77 90 top
C37  41.95,24.49 90 top
C38  20.1,60.21 0 top
C39  28.86,60.41 0 top
C40  19.87,56.33 0 top
D1  29.07,35.55 180 top
D2  69.95,57.82 0 top
D3  61.65,74.77 180 top
D5  15.72,74.91 0 top
D6  11.73,74.86 0 top
IC1  24.73,52.63 0 top
IC2  14.69,37.13 0 top
IC3  65.57,65.28 270 top
IC4  61.97,65.34 270 top
IC5  49.1,17.17 180 top
J1  39.45,75.92 0 top
JP1  3.27,35.38 90 top
LED  25.92,40.06 270 top
Q1  74.1,65.97 0 top
Q2  66.2,78.87 0 top
Q3  60.8,52.72 0 top
R1  21.44,40.09 180 top
R2  12.32,49.38 180 top
R3  7.82,28.17 90 top
R4  18.65,31.2 180 top
R5  22.79,31.2 0 top
R6  7.95,62.96 180 top
R7  7.51,74.26 180 top
R8  51.75,64.17 0 top
R9  75.8,57.82 90 top
R10  52.35,52.52 180 top
R11  51.75,67.72 0 top
R12  63.7,71.82 180 top
R13  59.1,71.92 180 top
R14  57.75,52.47 90 top
R15  64.35,52.57 270 top
R16  72.2,52.92 90 top
R17  51.7,60.97 0 top
R18  63.45,56.02 0 top
R19  49.15,13.82 180 top
R20  46.1,17.32 90 top
R21  21.95,27.57 180 top
R38  41.72,37.31 0 top
R39  41.87,29.31 180 top
R40  41.74,34.46 180 top
R41  41.84,31.96 180 top
R62  12.77,60.78 180 top
R63  11.92,72.28 0 top
R64  16.07,72.28 0 top
R65  30.72,64.18 0 top
R66  30.62,67.13 0 top
S1  19.48,44.76 0 top
S2  15.15,25.57 0 top
SW1  27.5,73.02 90 top
T1  19.99,66.76 0 top
T2  22.78,35.68 0 top
U1  2.2,68.56 0 top
U2  55.25,16.32 270 top
U$1  82.8,80.03 270 top
U$2  49.6,77.32 0 top
U$3  [RADIOACTIVE_10.00]  66.45,7.72 0 top
U$4  6.88,70.98 0 top
U$6  12.99,66.97 0 top
U$7  25.37,66.59 180 top
U$8  11.47,42.83 0 top
U$18  46.26,45.98 270 top
VR1  68.1,52.72 90 top

### Tracks (layer width: path | path; a pad name or v marks a point on that pad's centre or on a via)
B1
  Top 0.254: R3.1 8,27.17 8,24.17 C4.1 8.25,23.92 8.5,23.67 11.75,23.67 | IC2.12 17,39.92 17,38.67 31.5,38.67 34.5,35.67 34.5,23.67 18.75,23.67 S2.A' 18.5,23.67 11.75,23.67 | 11.75,23.67 S2.A
BUZZER  (via drill 0.61)
  Top 0.254: v18.5,34.17 17.75,34.17 IC2.10 | v18.5,29.92 18.5,31.17 17.75,31.17 R4.2
  Bottom 0.254: v18.5,29.92 v18.5,34.17
GM_INT  (via drill 0.61)
  Top 0.254: v67.25,25.42 67.25,54.67 65,56.92 61,56.92 C12.2 | v15.75,35.67 15,34.92 15,34.42 IC2.6
  Bottom 0.254: v67.25,25.42 55.75,13.92 33.25,13.92 15.75,31.42 v15.75,35.67
GND  (via drill 0.61)
  Top 0.254: C8.2 70.75,86.17 77.25,86.17 C9.2 | Q1.2 74.75,64.92 73.75,63.92 70,63.92 69.5,64.42 68.75,64.42 IC3.6 68.5,64.42 66.25,64.42 | 66.25,64.42 66,64.17 IC4.6 66.25,64.42 | 66.25,64.42 64,66.67 63,66.67 62.5,67.17 IC3.1 62.25,67.42 60.75,68.92 58.25,68.92 IC4.1 58,68.92 54.25,65.17 49.75,65.17 | T1.7 19.75,69.67 20.25,69.67 T1.6 20.25,69.92 20.25,70.42 22.75,70.42 24.5,68.67 25.5,68.67 25.75,68.92 27,68.92 27.25,68.67 31.5,68.67 32.5,67.67 32.5,66.17 | 32.5,66.17 30.75,66.17 30,66.92 R66.1 | VR1.2 65.75,53.42 R15.1 63.25,53.42 61.75,51.92 Q3.2 61.5,51.92 60.75,52.67 60.25,52.67 58.5,54.42 58.5,59.17 57,59.17 56.25,58.42 C11.2 56,58.17 54.5,58.17 52.25,55.92 C10.2 52,55.92 50.75,55.92 | 50.75,55.92 50.75,60.92 R17.1 51,61.17 51,64.17 R8.1 50.75,64.17 49.75,65.17 | 32.5,66.17 48.75,66.17 49.75,65.17 | 17.25,49.92 17.75,50.42 18.75,50.42 C2.2 19,50.42 19.75,49.67 22.25,49.67 IC1.1 22.5,49.67 24,51.17 30,51.17 30.5,50.67 C3.2 | 17.25,49.92 16.5,49.17 | 16.5,49.17 16,48.67 C22.2 | 9.75,63.17 9,63.17 R6.1 | 9.75,63.17 10,63.17 11,64.17 U$6.1 11.25,64.42 12,65.17 12.75,65.17 13.5,64.42 U$6.3 13.75,64.17 13.75,60.92 R62.1 13.75,60.67 18,60.67 18.25,60.42 C38.C 18.5,60.17 19.75,58.92 25.75,58.92 27,60.17 C39.C | 17.25,49.92 13.25,53.92 10.25,53.92 9.75,54.42 9.75,63.17 | S2.B 11.75,27.67 18.5,27.67 S2.B' 18.75,27.67 v20,28.92 | C20.1 13.75,46.42 11.75,46.42 C21.1 11.5,46.42 10.25,46.42 10.25,41.67 11.75,40.17 IC2.20 11.75,39.92 11.25,39.42 v10.75,39.42 | v20.5,34.67 21.75,34.67 T2.E | v17,48.67 16.5,49.17 | 44.75,40.17 48.25,40.17 U$18.P$8 | 44.75,40.17 42.5,40.17 C7.1 42.25,40.42 41.5,41.17 35,41.17
  Top 0.254: 44.75,40.17 46,38.92 48.25,38.92 U$18.P$10 | 25.75,41.17 24.25,42.67 22.25,42.67 S1.4 22,42.92 17,42.92 S1.3 16.75,42.92 v16.75,44.42 | 25.75,41.17 26.75,40.17 LED.C | 25.75,41.17 35,41.17 | U$18.P$12 48.5,37.42 48.5,36.92 U$18.P$13 48.5,36.67 50.5,36.67 | 48.5,34.67 48.5,33.92 U$18.P$17 | 48.5,34.67 48.5,35.17 U$18.P$15 48.5,35.42 50.75,35.42 | 48.5,34.67 U$18.P$16 | 50.5,36.67 50.75,36.42 50.75,35.42 | 48.5,30.42 48.5,29.92 U$18.P$23 48.5,29.67 48.5,29.17 U$18.P$24 48.5,28.92 48.5,28.42 U$18.P$25 48.5,28.17 50.5,28.17 53.25,25.42 | 48.5,30.42 48.5,31.17 | 48.5,30.42 U$18.P$22 | R19.2 48.25,13.92 48.75,14.42 49,14.42 49.5,14.92 U2.3 55.25,15.17 55.75,15.17 56.75,16.17 56.75,20.97 | 35,22.42 39,22.42 40.25,23.67 | 35,22.42 8.25,22.42 C4.2 | 40.25,23.67 41,24.42 C37.1 41.25,24.67 41.25,25.42 42.5,26.67 C5.1 42.75,26.92 42.75,27.67 41.25,29.17 R39.2 | 40.25,23.67 43.25,23.67 45,25.42 48.25,25.42 U$18.P$29 48.5,25.42 53.25,25.42 | 56.75,20.97 56.75,25.42 53.25,25.42 | 50.75,35.42 50.75,31.17 48.5,31.17 | 48.5,31.17 U$18.P$21 | 35,22.42 35,41.17 | 50.75,55.92 50.75,53.42 50.5,53.17 50.5,47.92 51.25,47.92 51.5,47.67 51.5,36.67 50.5,36.67 | 56.75,20.97 56.6,21.12 49.5,21.12 49.1,20.72 IC5.2
  Top 0.305: C4.2 5.11,22.46 C13.2
  Bottom 0.254: C8.2 70.5,85.92 69.75,85.92 56,72.17 56,71.17 58,69.17 IC4.1 | 20,34.67 19.25,34.67 17.25,36.67 10.75,36.67 | 10.75,36.67 8.5,36.67 3.5,31.67 JP1.2 | 10.75,36.67 v10.75,39.42 16.25,44.92 | 20,34.67 v20,28.92 | 20,34.67 v20.5,34.67 | v17,48.67 17,45.67 16.25,44.92 | v16.75,44.42 16.25,44.92
  pour Top: -2.75,91.17 94.3,91.17 94.3,-4.58 -2.75,-4.58
  pour Bottom: -2.75,91.22 94.35,91.22 94.35,-4.68 -2.75,-4.68
HV
  Top 0.806: U$2.P1 57.75,76.32 D3.A 62.92,78.39 63.85,78.39 63.85,79.57 64.1,79.82 66.13,79.82 Q2.3
I2C1_SCL  (via drill 0.61)
  Top 0.254: R41.2 40.75,32.17 39.5,33.42 v39.5,35.42 44,35.42 46.25,33.17 48.25,33.17 U$18.P$18 | v21.5,37.67 17.25,37.67 15.75,39.17 15.75,39.92 IC2.14
  Bottom 0.254: v21.5,37.67 37.25,37.67 v39.5,35.42
I2C1_SDA  (via drill 0.61)
  Top 0.254: R40.1 42.75,34.42 v43.75,33.42 44.5,32.67 48.25,32.67 U$18.P$19 48.5,32.42 48.5,31.92 U$18.P$20 | v15,38.67 15,39.92 IC2.15
  Bottom 0.254: v15,38.67 38.5,38.67 v43.75,33.42
LED
  Top 0.254: IC2.11 17.75,40.17 20.5,40.17 R1.2
N$1
  Top 0.254: C5.2 41,26.92 38.5,29.42 38.5,36.42 41.75,36.42 42.5,37.17 R38.2 42.75,37.17 43.75,36.17 48.25,36.17 U$18.P$14
N$2
  Top 0.254: C6.1 40.75,45.17 42.25,43.67 48.25,43.67 U$18.P$3
N$3
  Top 0.406: U1.VBUS1 4.9,72.55 R7.2
N$4  (via drill 0.61)
  Top 0.254: C1.+ 11,55.17 14.25,58.42 28.75,58.42 30.5,60.17 C39.A 30.75,60.42 31.5,60.42 31.5,64.17 R65.2 31.75,64.42 32,64.67 v33,64.67 | 27.5,69.92 26.5,70.92 16.25,70.92 15,69.67 U$6.5 | v29,69.92 27.5,69.92 | 27.5,69.92 SW1.COM1
  Bottom 0.254: 33,69.92 38,69.92 BT1.+ | 33,69.92 v29,69.92 | 33,69.92 v33,64.67
N$5
  Top 0.254: 20.9,30.17 22.5,30.17 22.75,30.42 22.75,34.42 23.5,34.42 T2.B | 20.9,30.17 20.75,30.17 19.75,31.17 R4.1 | 20.9,30.17 20.9,27.72 R21.2
N$6
  Top 0.254: LED.A 24.75,40.17 22.5,40.17 R1.1
N$7  (via drill 0.61)
  Top 0.254: T2.C 23,36.67 24,35.67 26.5,35.67 D1.A 26.5,35.42 v26.5,29.67 | R21.1 23.9,26.52 BUZZ1.-
  Bottom 0.254: v26.5,29.67 26.5,26.67 BUZZ1.-
N$8
  Top 0.254: 31.25,28.17 26.75,28.17 23.75,31.17 R5.2 | 31.25,28.17 32.75,26.67 BUZZ1.+ | 31.25,28.17 31.25,35.42 D1.C
N$9  (via drill 0.61)
  Top 0.254: v56,56.92 55.75,56.92 51.5,52.67 R10.2 | 64,60.17 62,60.17 58.25,63.92 IC4.3 | 64,60.17 74.25,60.17 75.75,58.67 R9.2 | 64,60.17 64,63.92 63.75,64.17 62.75,64.17 62.5,64.42 IC3.3
  Bottom 0.254: v56,56.92 56,61.92 58,63.92 IC4.3
N$10
  Top 0.254: R9.1 75.75,57.17 75.25,57.67 72.5,57.67 D2.A
N$11
  Top 0.254: U$4.2 8.5,71.42 8.5,74.17 R7.1
N$12
  Top 0.406: R6.2 4.9,65.11 U1.GND1 3.5,67.26 U1.GND
N$13  (via drill 0.61)
  Top 0.254: v55.5,52.67 53.25,52.67 R10.1 | Q2.1 65.25,77.67 64,76.42 62.5,76.42 61,74.92 61,72.92 56.75,72.92 56,72.17 56,70.42 61.75,70.42 65.5,66.67 65.75,66.67 IC4.7 66,66.42 68,66.42 68.5,65.92 IC3.7
  Bottom 0.254: v55.5,52.67 61.25,52.67 64.5,55.92 64.5,65.17 65.75,66.42 IC4.7
N$14
  Top 0.254: IC3.2 62.25,65.92 61.75,66.42 58.25,66.42 IC4.2 58,66.42 55.75,64.17 53.5,64.17 | 53.5,64.17 53.5,59.67 | 53.5,59.67 53.5,58.67 52.25,57.42 C10.1 | R8.2 53.5,64.17 | 53.5,59.67 65.75,59.67 67.5,57.92 D2.C
N$15  (via drill 0.61)
  Top 0.254: v54.5,66.67 52,66.67 51,67.67 R11.1 | v70.5,67.17 74,67.17 Q1.3 | IC3.4 62.25,63.42 61.75,63.92 60,63.92 58.5,65.42 57.75,65.42 56.75,64.42 56.75,61.67 58,61.67 IC4.4
  Bottom 0.254: v54.5,66.67 56.25,66.67 57.5,65.42 58.5,65.42 59.5,64.42 | 59.5,64.42 59.5,62.92 58.25,61.67 IC4.4 | v70.5,67.17 67,67.17 66.25,67.92 65.25,67.92 61.75,64.42 59.5,64.42
N$16
  Top 0.254: 75,65.92 74,65.92 73.25,65.17 Q1.1 | 75,65.92 76.75,65.92 76.75,56.17 76.5,55.92 74.25,55.92 72.25,53.92 R16.2 | 75,65.92 75,69.92 67.25,77.67 Q2.2
N$17
  Top 0.806: D3.C 64.55,74.22 R12.1 65.34,71.03 C8.1
N$18  (via drill 0.6)
  Top 0.806: R13.1 62.75,71.92 R12.2 62.9,71.77 v62.9,70.67 | C9.1 75.46,71.28 v75.4,71.22
  Bottom 0.806: v75.4,71.22 73.21,71.22 71.33,69.34 69.93,69.34 68.6,70.67 v62.9,70.67
N$19  (via drill 0.61)
  Top 0.254: 69.75,53.42 71,52.17 72,52.17 R16.1 | v51.75,58.67 52.5,58.67 52.5,60.92 R17.2 | v68.25,51.67 68.25,53.42 69.75,53.42 | 69.75,53.42 VR1.3
  Bottom 0.254: v51.75,58.67 51.75,55.17 55.25,51.67 v68.25,51.67
N$20
  Top 0.254: IC3.5 68.5,63.17 67,61.67 66,61.67 IC4.5
N$21  (via drill 0.6)
  Top 0.806: R13.2 v57.05,71.92
  Bottom 0.806: U$1.A 71.69,71.92 v57.05,71.92
N$22
  Top 0.254: U$1.C 87.75,1.92 87.55,2.28
  Top 0.806: C11.1 57.71,53.36 R14.2 57.21,52.78 57,52.78 56.64,52.42 56.64,30.38 84.3,2.72 87.11,2.72 87.55,2.28
N$23
  Top 0.254: R14.1 57.75,51.67 59.75,51.67 Q3.1 60,51.67 61,50.67 63.25,50.67 64.25,51.67 R15.2
N$24
  Top 0.254: IC3.8 68.5,67.42 67,68.92 66,68.92 IC4.8
  Bottom 0.254: J1.2 49.5,75.92 57.5,67.92 64.5,67.92 65.75,69.17 IC4.8
N$25
  Top 0.254: 61,55.92 62.5,55.92 R18.1 | 61,55.92 C12.1 | 61,55.92 61,53.92 Q3.3
N$26
  Top 0.254: 46.75,16.92 48.25,18.42 IC5.3 | 46.75,16.92 46.25,16.42 R20.1 | 46.75,16.92 49,16.92 49,15.17 48.75,14.92 47.5,14.92 47.5,12.92 47.75,12.67 49,12.67 50,13.67 R19.1
N$27
  Top 0.254: IC5.1 50.25,18.67 56,18.67 56.25,18.42 56.25,16.42 55.25,16.42 U2.2
N$28  (via drill 3.1)
  other vias: 64.8,87.52
N$29  (via drill 3.1)
  other vias: 64.85,2.72
N$30  (via drill 3.1)
  other vias: 2.9,11.97
N$31  (via drill 3.1)
  other vias: 2.65,77.52
N$39
  Top 0.254: C36.1 41,42.67 41.75,41.92 45.75,41.92 46,42.17 48.25,42.17 U$18.P$5
N$40
  Top 0.254: C6.2 42.5,45.17 43.25,44.42 U$18.P$2
N$41
  Top 0.254: C36.2 42.5,42.92 48.25,42.92 U$18.P$4
N$42
  Top 0.254: R39.1 42.75,29.17 43.75,28.17 45.75,28.17 46.25,27.67 48.25,27.67 U$18.P$26
N$43  (via drill 0.61)
  Top 0.254: v41,38.67 41,40.17 C7.2 | v45.5,27.17 45.75,26.92 U$18.P$27
  Bottom 0.254: v41,38.67 41,37.42 45.5,32.92 v45.5,27.17
N$44
  Top 0.254: C37.2 42.75,24.67 44.25,26.17 48.25,26.17 U$18.P$28
N$58
  Top 0.254: U$6.2 12.25,64.17 12.25,60.92 12,60.92 R62.2
N$59
  Top 0.254: U$6.7 12.25,69.67 12.25,71.42 12,71.42 11.25,72.17 R63.1
N$60
  Top 0.254: U$6.6 13.75,69.67 13.75,72.17 15,72.17 R64.1
N$61
  Top 0.254: D6.C 12.75,74.92 13.75,75.92 15.25,75.92 15.75,75.42 15.75,73.17 13.75,73.17 13,72.42 R63.2
N$62
  Top 0.254: D5.C 16.75,74.67 16.75,72.42 R64.2
N$65
  Top 0.254: U$7.5 25.5,65.42 25.5,64.42 29.75,64.42 R65.1 30,64.42 31.25,65.67 34,65.67 34,61.67 30.25,57.92 20.75,57.92 19.25,56.42 C40.1
N$66  (via drill 0.61)
  Top 0.254: 20.75,62.92 20.5,62.92 20,63.42 | 20.75,62.92 21.5,62.92 21.5,63.67 24,66.17 25.75,66.17 26.25,65.67 U$7.6 | 20,63.42 19.75,63.67 T1.2 | 20,63.42 20.25,63.67 T1.3 | C40.2 20.5,56.17 19.5,55.17 14.5,55.17 C1.- | v20.75,62.67 20.75,62.92
  Bottom 0.254: C1.- 14.5,55.17 20.75,61.42 v20.75,62.67 20.75,65.92 25.75,70.92 29.25,70.92 31.5,73.17 39.75,73.17 43,69.92 BT1.-
N$67
  Top 0.254: U$7.1 25.25,66.67 23.75,66.67 21,63.92 T1.4
N$68
  Top 0.254: U$7.2 25.5,67.92 26,68.42 26.75,68.42 27,68.17 30.25,68.17 31.25,67.17 R66.2
N$69
  Top 0.254: T1.1 19,63.92 19,69.67 T1.8
N$70
  Top 0.254: U$7.3 24.25,67.92 22.5,69.67 21,69.67 T1.5
OSC32_IN
  Top 0.254: C21.2 11.5,44.92 11.5,42.92 U$8.1 11.5,42.67 12.5,42.67 12.5,40.17 IC2.19
OSC32_OUT
  Top 0.254: C20.2 14,44.92 14,42.92 U$8.2 13.75,42.67 13,42.67 13,40.17 IC2.18
RST
  Top 0.254: C22.1 15.75,49.92 15.25,49.42 13.25,49.42 R2.1 13,49.42 12,50.42 10.75,50.42 10.5,50.17 10.5,47.42 | 15.75,46.42 15.75,42.42 14.75,41.42 14.5,41.42 14.5,40.17 IC2.16 | 15.75,46.42 16.75,46.42 S1.1 17,46.67 22,46.67 S1.2 | 10.5,47.42 14.75,47.42 15.75,46.42 | 10.5,47.42 9,47.42 3.5,41.92 JP1.6
RX
  Top 0.254: IC2.4 13.75,34.17 13.75,33.17 18.75,33.17 19.5,33.92 19.5,36.67 3.5,36.67 JP1.4
TEMPRATURE  (via drill 0.61)
  Top 0.254: v14.25,35.67 14.25,34.42 IC2.5 | 42.5,18.42 46,18.42 R20.2 | 42.5,18.42 v27.5,18.42 | 42.5,18.42 45.25,15.67 48,15.67 IC5.4
  Bottom 0.254: v14.25,35.67 14.25,31.67 v27.5,18.42
TEST
  Top 0.254: IC2.17 13.75,39.92 13.75,38.42 4.25,38.42 3.5,39.17 JP1.5
TX
  Top 0.254: IC2.3 13,34.42 13,35.17 4.5,35.17 3.5,34.17 JP1.3
VBUS
  Top 0.254: 11.25,74.42 11.75,73.92 14,73.92 14.75,74.67 D5.A | 11.25,74.42 11,74.67 D6.A 11.25,74.42 | 9.75,69.67 11,69.67 U$6.8 | 9.75,69.67 9.5,69.67 | 9.5,69.67 8.5,69.67 7,71.17 U$4.1 | 9.5,69.67 14.75,64.42 U$6.4 15,64.17 16.25,62.92 19.25,62.92 21.75,60.42 C38.A | 11.25,74.42 9.75,72.92 9.75,69.67
VCC  (via drill 0.61)
  Top 0.254: IC1.3 27.25,49.42 31.75,49.42 31.75,50.92 30.75,51.92 C3.1 30.5,52.17 27,52.17 v26,53.17 | v26,69.92 25,69.92 SW1.CH1A
  Bottom 0.254: v26,53.17 v26,69.92
VDD  (via drill 0.61)
  Top 0.254: R38.1 41,37.42 41.75,38.17 48.25,38.17 U$18.P$11 48.5,38.17 50.75,38.17 50.75,39.17 50.5,39.42 | 50.5,39.42 48.5,39.42 U$18.P$9 | 50.5,41.42 50.75,41.17 50.75,39.42 50.5,39.42 | 50.5,41.42 50.25,41.67 48.5,41.67 U$18.P$6 | C2.1 19,52.42 22.25,55.67 24.5,55.67 IC1.4 24.75,55.67 26.25,54.17 30.25,54.17 32.25,52.17 32.25,47.92 | 23.25,47.92 24.75,49.42 IC1.2 | 23.25,47.92 23,47.67 15.25,47.67 15,47.92 12.75,47.92 11.5,49.17 R2.2 | 23.25,47.92 32.25,47.92 | 50.5,41.42 51,41.92 51,47.42 v46.5,47.42 32.75,47.42 32.25,47.92 | R11.2 52.5,67.92 52.5,72.42 52.25,72.42 U$2.P2 52,72.67 50.25,74.42 41,74.42 39.5,75.92 J1.1 | v62,54.67 63,54.67 64.25,55.92 R18.2 | 6.75,29.17 3.5,29.17 JP1.1 | 6.75,29.17 7.75,29.17 R3.2 | 6.75,29.17 10.25,32.67 | 10.25,32.67 11.75,34.17 IC2.1 | 21,32.17 20.5,32.67 10.25,32.67 | 21,32.17 21.75,31.42 R5.1 | R40.2 41,34.42 41,33.67 42.5,32.17 R41.1 42.75,31.92 43.5,31.17 v44,31.17 | IC5.5 50.25,15.92 52,17.67 55.25,17.67 U2.1 | v21,32.42 21,32.17
  Top 0.305: JP1.1 3.27,22.6 C13.1
  Bottom 0.254: v62,54.67 57,54.67 51.75,59.92 | 51.75,59.92 45,66.67 45,72.92 43.5,74.42 41,74.42 39.5,75.92 J1.1 | 46.5,24.92 53.5,17.92 55.25,17.92 U2.1 | 46.5,24.92 44,27.42 v44,31.17 42.75,32.42 v21,32.42 | 51.75,59.92 46.5,54.67 v46.5,47.42 46.5,24.92

### Text on the board
tPlace: HV_SW | HV Area | RST / TEST / RX / TX / GND / VDD | MSP430Geiger Counter-βγ / Random Number Generator / TonyGUO 2020/02/14